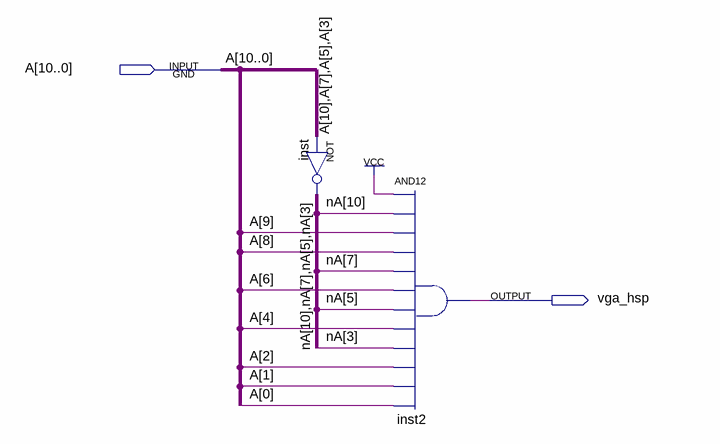
[diagram p0: schematic sheet]
// Quartus schematic vga_hsp.bdf as structural Verilog: 2 symbols, 2 pins
module vga_hsp (
  input  [10:0] A,
  output vga_hsp
);

  wire [10:3] nA;

  assign {nA[10], nA[7], nA[5], nA[3]} = ~{A[10], A[7], A[5], A[3]};  // NOT inst, 4 bits wide
  and inst2 (vga_hsp, 1'b1, nA[10], A[9], A[8], nA[7], A[6], nA[5], A[4], nA[3], A[2], A[1], A[0]);
endmodule
